# EAGLE design 0_cpu_interface (EAGLE 6.6.0)

## Sheet 1 of 2
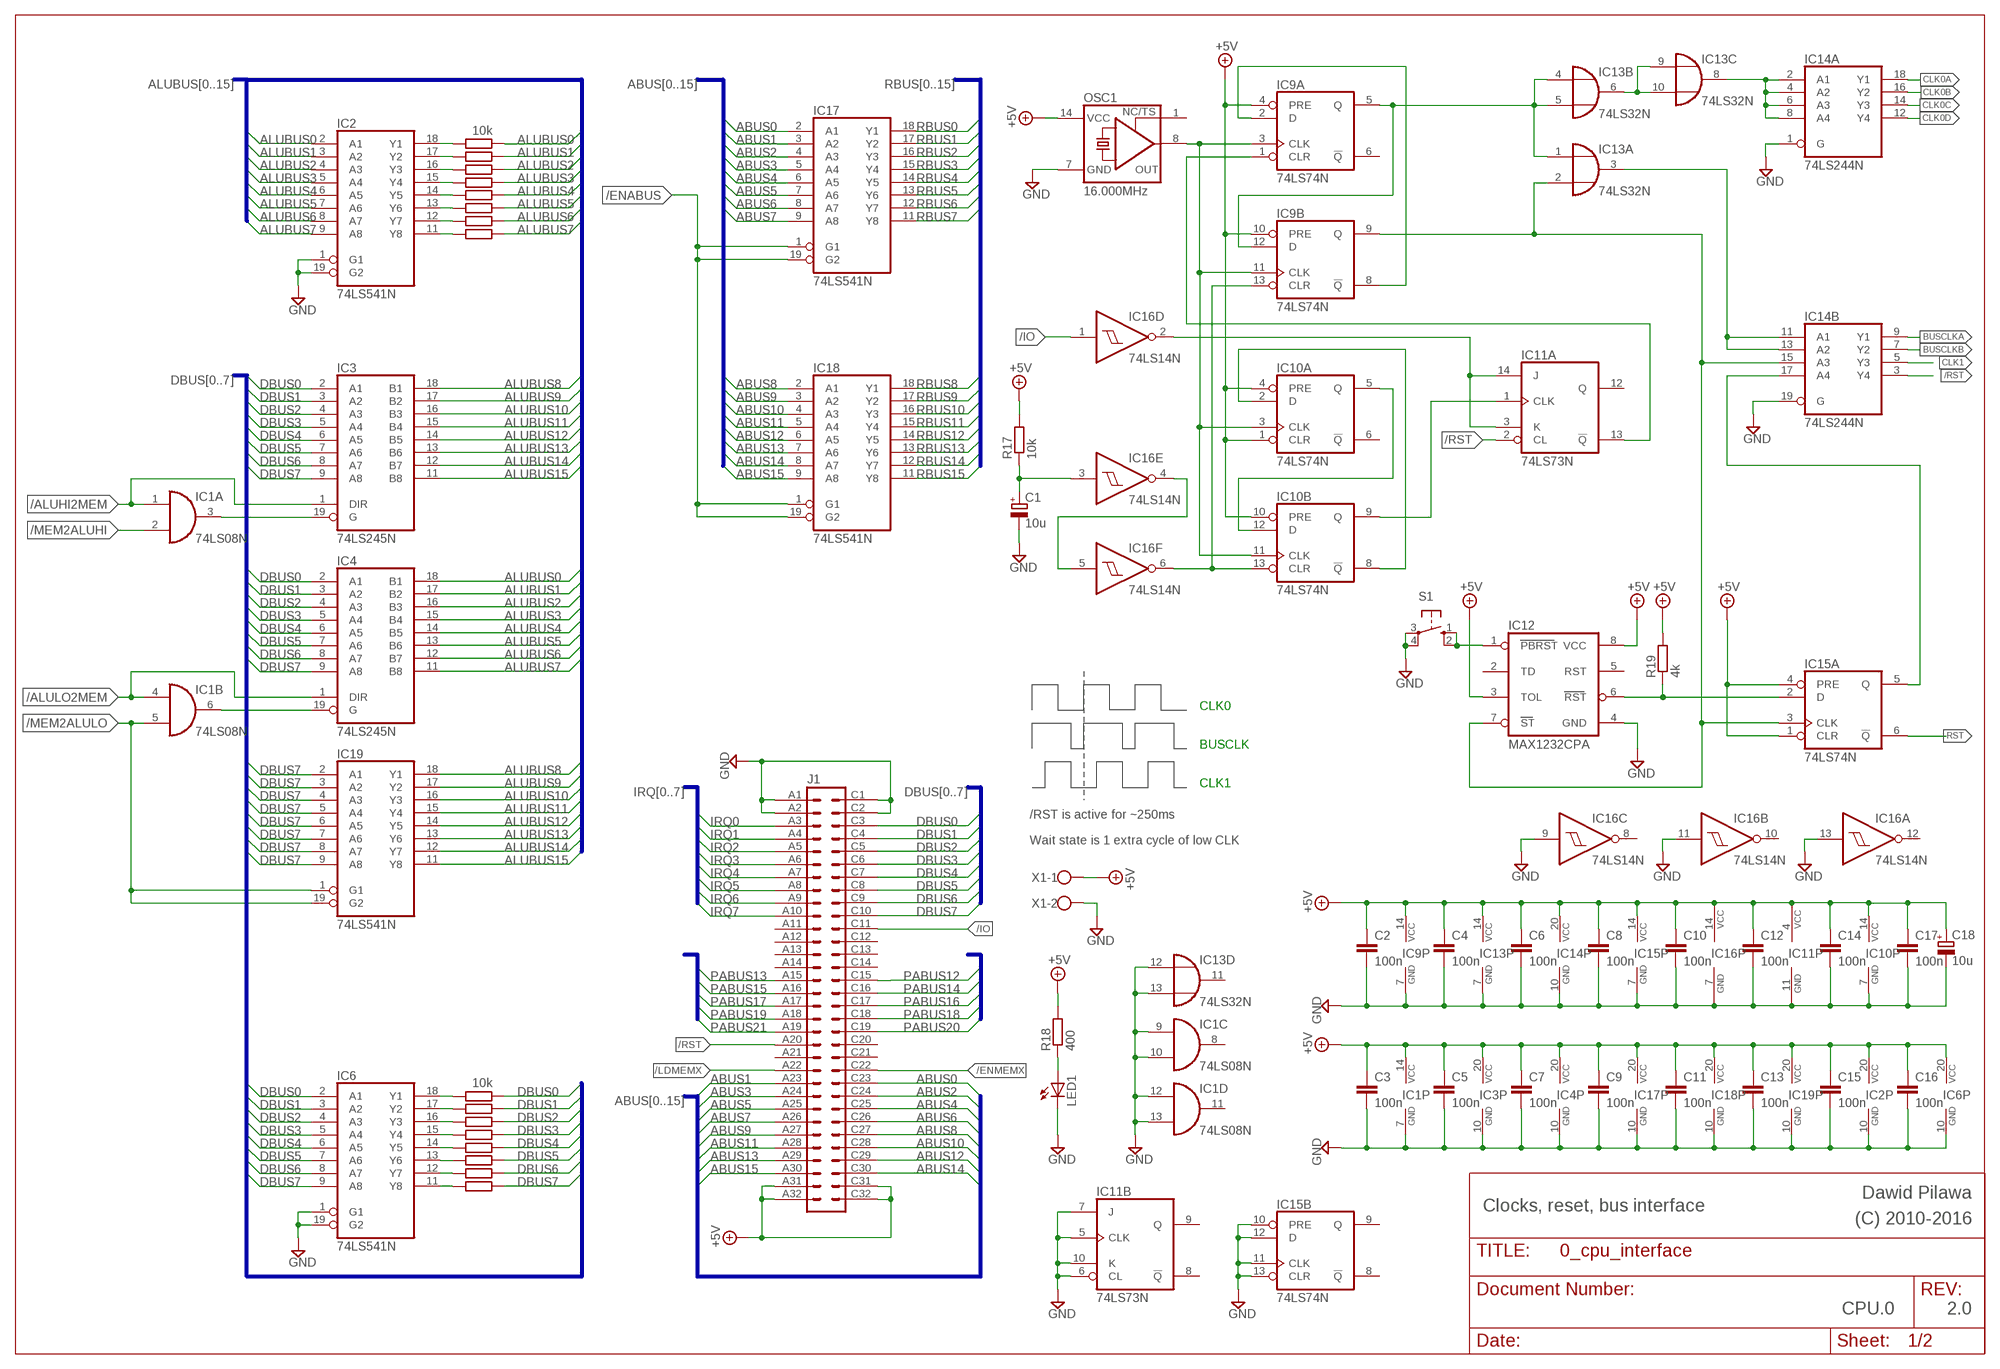
[diagram p0: schematic, sheet 1]

### Parts
C1  10u  CPOL-EUE2.5-5  [E2,5-5]
C2  100n  C-EU050-024X044  [C050-024X044]
C3  100n  C-EU050-024X044  [C050-024X044]
C4  100n  C-EU050-024X044  [C050-024X044]
C5  100n  C-EU050-024X044  [C050-024X044]
C6  100n  C-EU050-024X044  [C050-024X044]
C7  100n  C-EU050-024X044  [C050-024X044]
C8  100n  C-EU050-024X044  [C050-024X044]
C9  100n  C-EU050-024X044  [C050-024X044]
C10  100n  C-EU050-024X044  [C050-024X044]
C11  100n  C-EU050-024X044  [C050-024X044]
C12  100n  C-EU050-024X044  [C050-024X044]
C13  100n  C-EU050-024X044  [C050-024X044]
C14  100n  C-EU050-024X044  [C050-024X044]
C15  100n  C-EU050-024X044  [C050-024X044]
C16  100n  C-EU050-024X044  [C050-024X044]
C17  100n  C-EU050-024X044  [C050-024X044]
C18  10u  CPOL-EUE2.5-6  [E2,5-6]
IC1  74LS08N  [DIL14]
IC2  74LS541N  [DIL20]
IC3  74LS245N  [DIL20]
IC4  74LS245N  [DIL20]
IC6  74LS541N  [DIL20]
IC9  74LS74N  [DIL14]
IC10  74LS74N  [DIL14]
IC11  74LS73N  [DIL14]
IC12  MAX1232CPA  [DIL08]
IC13  74LS32N  [DIL14]
IC14  74LS244N  [DIL20]
IC15  74LS74N  [DIL14]
IC16  74LS14N  [DIL14]
IC17  74LS541N  [DIL20]
IC18  74LS541N  [DIL20]
IC19  74LS541N  [DIL20]
J1  VG64B  [VG64B]
LED1  LED5MM  [LED5MM]
OSC1  16.000MHz  XO-14  [DIL14S]
R1  10k  R-EU_0204/7  [0204/7]
R2  R-EU_0204/7  [0204/7]
R3  R-EU_0204/7  [0204/7]
R4  R-EU_0204/7  [0204/7]
R5  R-EU_0204/7  [0204/7]
R6  R-EU_0204/7  [0204/7]
R7  R-EU_0204/7  [0204/7]
R8  R-EU_0204/7  [0204/7]
R9  10k  R-EU_0204/7  [0204/7]
R10  R-EU_0204/7  [0204/7]
R11  R-EU_0204/7  [0204/7]
R12  R-EU_0204/7  [0204/7]
R13  R-EU_0204/7  [0204/7]
R14  R-EU_0204/7  [0204/7]
R15  R-EU_0204/7  [0204/7]
R16  R-EU_0204/7  [0204/7]
R17  10k  R-EU_0204/7  [0204/7]
R18  400  R-EU_0204/7  [0204/7]
R19  4k  R-EU_0204/7  [0204/7]
S1  10-XX  [B3F-10XX]
X1  W237-102  [W237-102]

### Nets
+5V: C2.1 C3.1 C4.1 C5.1 C6.1 C7.1 C8.1 C9.1 C10.1 C11.1 C12.1 C13.1 C14.1 C15.1 C16.1 C17.1 C18.+ IC1.14(P:VCC) IC2.20(VCC) IC3.20(VCC) IC4.20(VCC) IC6.20(VCC) IC9.4(A:PRE) IC9.10(B:PRE) IC9.14(P:VCC) IC10.1(A:CLR) IC10.4(A:PRE) IC10.10(B:PRE) IC10.14(P:VCC) IC11.4(P:VCC) IC12.3(TOL) IC12.8(VCC) IC13.14(P:VCC) IC14.20(P:VCC) IC15.1(A:CLR) IC15.4(A:PRE) IC15.14(P:VCC) IC16.14(P:VCC) IC17.20(VCC) IC18.20(VCC) IC19.20(VCC) J1.A31 J1.A32 J1.C31 J1.C32 OSC1.14(VCC) R17.2 R18.2 R19.2 X1.1 ; also sheet 2
/ALUHI2MEM: IC1.1(A:I0) IC3.1(DIR) ; also sheet 2
/ALULO2MEM: IC1.4(B:I0) IC4.1(DIR) ; also sheet 2
/ENABUS: IC17.1(G1) IC17.19(G2) IC18.1(G1) IC18.19(G2) ; also sheet 2
/ENMEMX: J1.C22 ; also sheet 2
/IO: IC16.1(D:I) J1.C11 ; also sheet 2
/LDMEMX: J1.A22 ; also sheet 2
/MEM2ALUHI: IC1.2(A:I1) ; also sheet 2
/MEM2ALULO: IC1.5(B:I1) IC19.1(G1) IC19.19(G2) ; also sheet 2
/RST: IC11.2(A:CL) IC14.3(B:Y4) J1.A20 ; also sheet 2
ABUS0: IC17.2(A1) J1.C23 ; also sheet 2
ABUS1: IC17.3(A2) J1.A23 ; also sheet 2
ABUS2: IC17.4(A3) J1.C24 ; also sheet 2
ABUS3: IC17.5(A4) J1.A24 ; also sheet 2
ABUS4: IC17.6(A5) J1.C25 ; also sheet 2
ABUS5: IC17.7(A6) J1.A25 ; also sheet 2
ABUS6: IC17.8(A7) J1.C26 ; also sheet 2
ABUS7: IC17.9(A8) J1.A26 ; also sheet 2
ABUS8: IC18.2(A1) J1.C27 ; also sheet 2
ABUS9: IC18.3(A2) J1.A27 ; also sheet 2
ABUS10: IC18.4(A3) J1.C28 ; also sheet 2
ABUS11: IC18.5(A4) J1.A28 ; also sheet 2
ABUS12: IC18.6(A5) J1.C29 ; also sheet 2
ABUS13: IC18.7(A6) J1.A29 ; also sheet 2
ABUS14: IC18.8(A7) J1.C30 ; also sheet 2
ABUS15: IC18.9(A8) J1.A30 ; also sheet 2
ALUBUS0: IC2.2(A1) IC4.18(B1) R1.2 ; also sheet 2
ALUBUS1: IC2.3(A2) IC4.17(B2) R2.2 ; also sheet 2
ALUBUS2: IC2.4(A3) IC4.16(B3) R3.2 ; also sheet 2
ALUBUS3: IC2.5(A4) IC4.15(B4) R4.2 ; also sheet 2
ALUBUS4: IC2.6(A5) IC4.14(B5) R5.2 ; also sheet 2
ALUBUS5: IC2.7(A6) IC4.13(B6) R6.2 ; also sheet 2
ALUBUS6: IC2.8(A7) IC4.12(B7) R7.2 ; also sheet 2
ALUBUS7: IC2.9(A8) IC4.11(B8) R8.2 ; also sheet 2
ALUBUS8: IC3.18(B1) IC19.18(Y1) ; also sheet 2
ALUBUS9: IC3.17(B2) IC19.17(Y2) ; also sheet 2
ALUBUS10: IC3.16(B3) IC19.16(Y3) ; also sheet 2
ALUBUS11: IC3.15(B4) IC19.15(Y4) ; also sheet 2
ALUBUS12: IC3.14(B5) IC19.14(Y5) ; also sheet 2
ALUBUS13: IC3.13(B6) IC19.13(Y6) ; also sheet 2
ALUBUS14: IC3.12(B7) IC19.12(Y7) ; also sheet 2
ALUBUS15: IC3.11(B8) IC19.11(Y8) ; also sheet 2
BUSCLK: IC13.3(A:O) IC14.11(B:A1) IC14.13(B:A2)
BUSCLKA: IC14.9(B:Y1) ; also sheet 2
BUSCLKB: IC14.7(B:Y2) ; also sheet 2
CLK0: IC9.5(A:Q) IC9.12(B:D) IC13.1(A:I0) IC13.4(B:I0) IC13.5(B:I1)
CLK0A: IC14.18(A:Y1) ; also sheet 2
CLK0B: IC14.16(A:Y2) ; also sheet 2
CLK0C: IC14.14(A:Y3) ; also sheet 2
CLK0D: IC14.12(A:Y4) ; also sheet 2
CLK1: IC14.5(B:Y3) ; also sheet 2
DBUS0: IC3.2(A1) IC4.2(A1) IC6.2(A1) J1.C3 R9.2 ; also sheet 2
DBUS1: IC3.3(A2) IC4.3(A2) IC6.3(A2) J1.C4 R10.2 ; also sheet 2
DBUS2: IC3.4(A3) IC4.4(A3) IC6.4(A3) J1.C5 R11.2 ; also sheet 2
DBUS3: IC3.5(A4) IC4.5(A4) IC6.5(A4) J1.C6 R12.2 ; also sheet 2
DBUS4: IC3.6(A5) IC4.6(A5) IC6.6(A5) J1.C7 R13.2 ; also sheet 2
DBUS5: IC3.7(A6) IC4.7(A6) IC6.7(A6) J1.C8 R14.2 ; also sheet 2
DBUS6: IC3.8(A7) IC4.8(A7) IC6.8(A7) J1.C9 R15.2 ; also sheet 2
DBUS7: IC3.9(A8) IC4.9(A8) IC6.9(A8) IC19.2(A1) IC19.3(A2) IC19.4(A3) IC19.5(A4) IC19.6(A5) IC19.7(A6) IC19.8(A7) IC19.9(A8) J1.C10 R16.2 ; also sheet 2
GND: C1.- C2.2 C3.2 C4.2 C5.2 C6.2 C7.2 C8.2 C9.2 C10.2 C11.2 C12.2 C13.2 C14.2 C15.2 C16.2 C17.2 C18.- IC1.7(P:GND) IC1.9(C:I0) IC1.10(C:I1) IC1.12(D:I0) IC1.13(D:I1) IC2.1(G1) IC2.10(GND) IC2.19(G2) IC3.10(GND) IC4.10(GND) IC6.1(G1) IC6.10(GND) IC6.19(G2) IC9.7(P:GND) IC10.7(P:GND) IC11.5(B:CLK) IC11.6(B:CL) IC11.7(B:J) IC11.10(B:K) IC11.11(P:GND) IC12.4(GND) IC13.7(P:GND) IC13.12(D:I0) IC13.13(D:I1) IC14.1(A:G) IC14.10(P:GND) IC14.19(B:G) IC15.7(P:GND) IC15.10(B:PRE) IC15.11(B:CLK) IC15.12(B:D) IC15.13(B:CLR) IC16.7(P:GND) IC16.9(C:I) IC16.11(B:I) IC16.13(A:I) IC17.10(GND) IC18.10(GND) IC19.10(GND) J1.A1 J1.A2 J1.C1 J1.C2 LED1.K(C) OSC1.7(GND) S1.3(P) S1.4(P1) X1.2 ; also sheet 2
IRQ0: J1.A3 ; also sheet 2
IRQ1: J1.A4 ; also sheet 2
IRQ2: J1.A5 ; also sheet 2
IRQ3: J1.A6 ; also sheet 2
IRQ4: J1.A7 ; also sheet 2
IRQ5: J1.A8 ; also sheet 2
IRQ6: J1.A9 ; also sheet 2
IRQ7: J1.A10 ; also sheet 2
N$1: IC1.3(A:O) IC3.19(G)
N$2: IC1.6(B:O) IC4.19(G)
N$3: IC2.18(Y1) R1.1
N$4: IC2.17(Y2) R2.1
N$5: IC2.16(Y3) R3.1
N$6: IC2.15(Y4) R4.1
N$7: IC2.14(Y5) R5.1
N$8: IC2.13(Y6) R6.1
N$9: IC2.12(Y7) R7.1
N$10: IC2.11(Y8) R8.1
N$11: IC6.18(Y1) R9.1
N$12: IC6.17(Y2) R10.1
N$13: IC6.16(Y3) R11.1
N$14: IC6.15(Y4) R12.1
N$15: IC6.14(Y5) R13.1
N$16: IC6.12(Y7) R15.1
N$17: IC6.11(Y8) R16.1
N$18: IC6.13(Y6) R14.1
N$19: IC12.1(PBRST) S1.1(S) S1.2(S1)
N$20: IC9.3(A:CLK) IC9.11(B:CLK) IC10.3(A:CLK) IC10.11(B:CLK) OSC1.8(OUT)
N$21: LED1.A R18.1
N$22: IC9.2(A:D) IC9.8(B:!Q)
N$23: IC14.17(B:A4) IC15.5(A:Q)
N$24: IC12.6(RST) IC15.2(A:D) R19.1
N$25: IC10.2(A:D) IC10.8(B:!Q)
N$26: IC13.8(C:O) IC14.2(A:A1) IC14.4(A:A2) IC14.6(A:A3) IC14.8(A:A4)
N$27: IC9.1(A:CLR) IC11.13(A:!Q)
N$28: C1.+ IC16.3(E:I) R17.1
N$29: IC13.6(B:O) IC13.9(C:I0) IC13.10(C:I1)
N$30: IC9.9(B:Q) IC12.7(ST) IC13.2(A:I1) IC14.15(B:A3) IC15.3(A:CLK)
N$31: IC10.5(A:Q) IC10.12(B:D)
N$32: IC10.9(B:Q) IC11.1(A:CLK)
N$33: IC11.3(A:K) IC11.14(A:J) IC16.2(D:O)
N$34: IC16.4(E:O) IC16.5(F:I)
N$35: IC9.13(B:CLR) IC10.13(B:CLR) IC16.6(F:O)
PABUS12: J1.C15 ; also sheet 2
PABUS13: J1.A15 ; also sheet 2
PABUS14: J1.C16 ; also sheet 2
PABUS15: J1.A16 ; also sheet 2
PABUS16: J1.C17 ; also sheet 2
PABUS17: J1.A17 ; also sheet 2
PABUS18: J1.C18 ; also sheet 2
PABUS19: J1.A18 ; also sheet 2
PABUS20: J1.C19 ; also sheet 2
PABUS21: J1.A19 ; also sheet 2
RBUS0: IC17.18(Y1) ; also sheet 2
RBUS1: IC17.17(Y2) ; also sheet 2
RBUS2: IC17.16(Y3) ; also sheet 2
RBUS3: IC17.15(Y4) ; also sheet 2
RBUS4: IC17.14(Y5) ; also sheet 2
RBUS5: IC17.13(Y6) ; also sheet 2
RBUS6: IC17.12(Y7) ; also sheet 2
RBUS7: IC17.11(Y8) ; also sheet 2
RBUS8: IC18.18(Y1) ; also sheet 2
RBUS9: IC18.17(Y2) ; also sheet 2
RBUS10: IC18.16(Y3) ; also sheet 2
RBUS11: IC18.15(Y4) ; also sheet 2
RBUS12: IC18.14(Y5) ; also sheet 2
RBUS13: IC18.13(Y6) ; also sheet 2
RBUS14: IC18.12(Y7) ; also sheet 2
RBUS15: IC18.11(Y8) ; also sheet 2
RST: IC15.6(A:!Q) ; also sheet 2
Unconnected: IC1.8(C:O) IC1.11(D:O) IC9.6(A:!Q) IC10.6(A:!Q) IC11.8(B:!Q) IC11.9(B:Q) IC11.12(A:Q) IC12.2(TD) IC12.5(RST) IC13.11(D:O) IC15.8(B:!Q) IC15.9(B:Q) IC16.8(C:O) IC16.10(B:O) IC16.12(A:O) J1.A11 J1.A12 J1.A13 J1.A14 J1.A21 J1.C12 J1.C13 J1.C14 J1.C20 J1.C21 OSC1.1(TS)

### Buses
DBUS[0..7]
ALUBUS[0..15]
RBUS[0..15]
IRQ[0..7]
ABUS[0..15]
PABUS[12..21]

### Notes on the sheet
- CLK0
- BUSCLK
- CLK1
- /RST is active for ~250ms
- Wait state is 1 extra cycle of low CLK
- Dawid Pilawa
- Clocks, reset, bus interface | (C) 2010-2016
- CPU.0 | 2.0

## Sheet 2 of 2
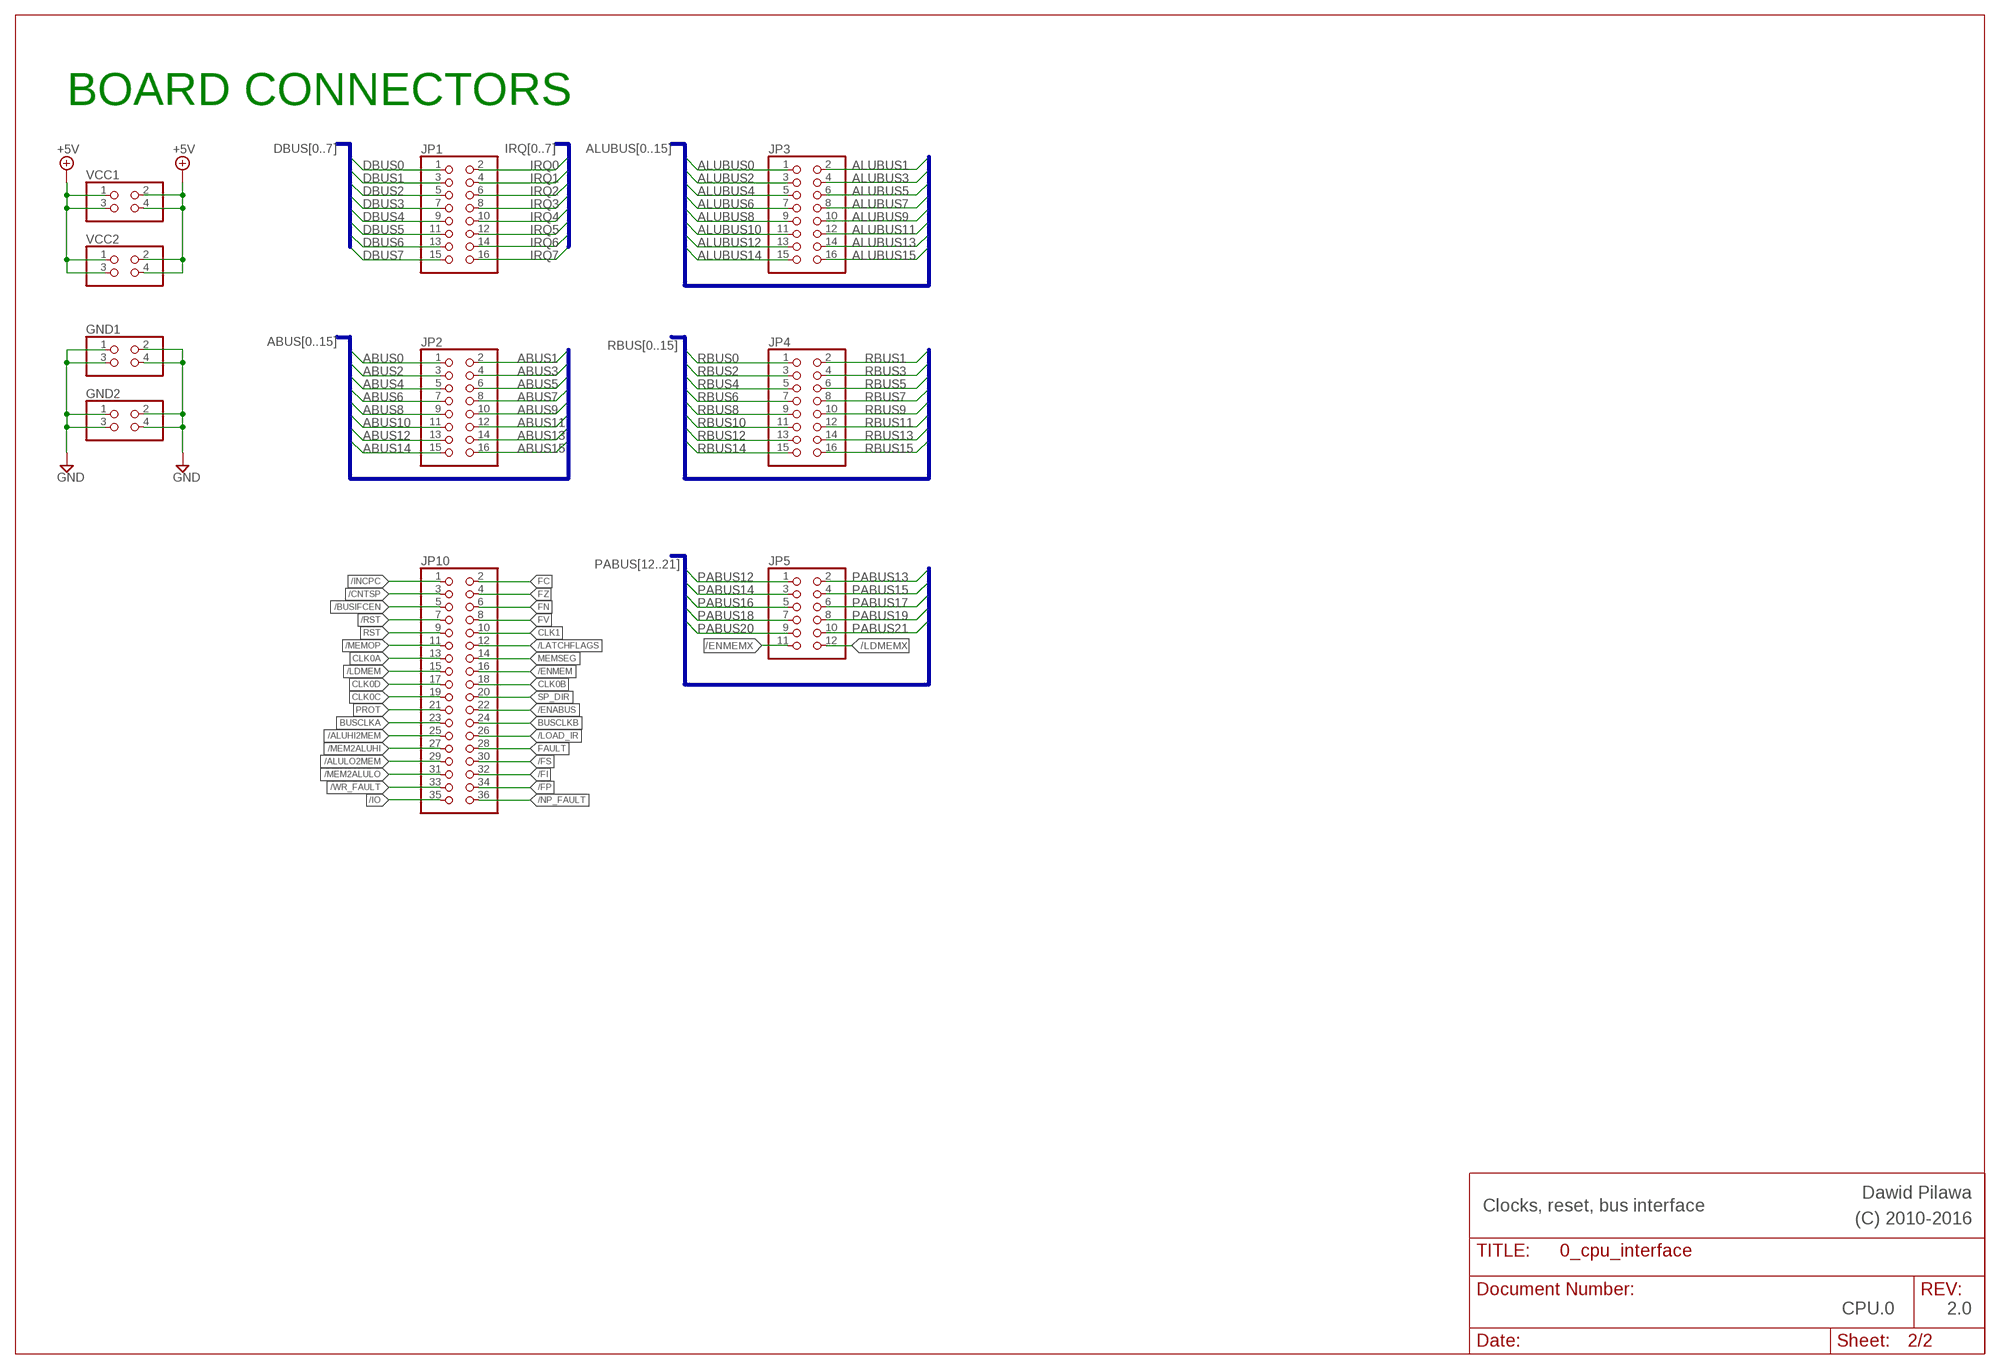
[diagram p1: schematic, sheet 2]

### Parts
GND1  PINHD-2X2  [2X02]
GND2  PINHD-2X2  [2X02]
JP1  PINHD-2X8  [2X08]
JP2  PINHD-2X8  [2X08]
JP3  PINHD-2X8  [2X08]
JP4  PINHD-2X8  [2X08]
JP5  PINHD-2X6  [2X06]
JP10  PINHD-2X18  [2X18]
VCC1  PINHD-2X2  [2X02]
VCC2  PINHD-2X2  [2X02]

### Nets
+5V: VCC1.1 VCC1.2 VCC1.3 VCC1.4 VCC2.1 VCC2.2 VCC2.3 VCC2.4 ; also sheet 1
/ALUHI2MEM: JP10.25 ; also sheet 1
/ALULO2MEM: JP10.29 ; also sheet 1
/BUSIFCEN: JP10.5
/CNTSP: JP10.3
/ENABUS: JP10.22 ; also sheet 1
/ENMEM: JP10.16
/ENMEMX: JP5.11 ; also sheet 1
/FI: JP10.32
/FP: JP10.34
/FS: JP10.30
/INCPC: JP10.1
/IO: JP10.35 ; also sheet 1
/LATCHFLAGS: JP10.12
/LDMEM: JP10.15
/LDMEMX: JP5.12 ; also sheet 1
/LOAD_IR: JP10.26
/MEM2ALUHI: JP10.27 ; also sheet 1
/MEM2ALULO: JP10.31 ; also sheet 1
/MEMOP: JP10.11
/NP_FAULT: JP10.36
/RST: JP10.7 ; also sheet 1
/WR_FAULT: JP10.33
ABUS0: JP2.1 ; also sheet 1
ABUS1: JP2.2 ; also sheet 1
ABUS2: JP2.3 ; also sheet 1
ABUS3: JP2.4 ; also sheet 1
ABUS4: JP2.5 ; also sheet 1
ABUS5: JP2.6 ; also sheet 1
ABUS6: JP2.7 ; also sheet 1
ABUS7: JP2.8 ; also sheet 1
ABUS8: JP2.9 ; also sheet 1
ABUS9: JP2.10 ; also sheet 1
ABUS10: JP2.11 ; also sheet 1
ABUS11: JP2.12 ; also sheet 1
ABUS12: JP2.13 ; also sheet 1
ABUS13: JP2.14 ; also sheet 1
ABUS14: JP2.15 ; also sheet 1
ABUS15: JP2.16 ; also sheet 1
ALUBUS0: JP3.1 ; also sheet 1
ALUBUS1: JP3.2 ; also sheet 1
ALUBUS2: JP3.3 ; also sheet 1
ALUBUS3: JP3.4 ; also sheet 1
ALUBUS4: JP3.5 ; also sheet 1
ALUBUS5: JP3.6 ; also sheet 1
ALUBUS6: JP3.7 ; also sheet 1
ALUBUS7: JP3.8 ; also sheet 1
ALUBUS8: JP3.9 ; also sheet 1
ALUBUS9: JP3.10 ; also sheet 1
ALUBUS10: JP3.11 ; also sheet 1
ALUBUS11: JP3.12 ; also sheet 1
ALUBUS12: JP3.13 ; also sheet 1
ALUBUS13: JP3.14 ; also sheet 1
ALUBUS14: JP3.15 ; also sheet 1
ALUBUS15: JP3.16 ; also sheet 1
BUSCLKA: JP10.23 ; also sheet 1
BUSCLKB: JP10.24 ; also sheet 1
CLK0A: JP10.13 ; also sheet 1
CLK0B: JP10.18 ; also sheet 1
CLK0C: JP10.19 ; also sheet 1
CLK0D: JP10.17 ; also sheet 1
CLK1: JP10.10 ; also sheet 1
DBUS0: JP1.1 ; also sheet 1
DBUS1: JP1.3 ; also sheet 1
DBUS2: JP1.5 ; also sheet 1
DBUS3: JP1.7 ; also sheet 1
DBUS4: JP1.9 ; also sheet 1
DBUS5: JP1.11 ; also sheet 1
DBUS6: JP1.13 ; also sheet 1
DBUS7: JP1.15 ; also sheet 1
FAULT: JP10.28
FC: JP10.2
FN: JP10.6
FV: JP10.8
FZ: JP10.4
GND: GND1.1 GND1.2 GND1.3 GND1.4 GND2.1 GND2.2 GND2.3 GND2.4 ; also sheet 1
IRQ0: JP1.2 ; also sheet 1
IRQ1: JP1.4 ; also sheet 1
IRQ2: JP1.6 ; also sheet 1
IRQ3: JP1.8 ; also sheet 1
IRQ4: JP1.10 ; also sheet 1
IRQ5: JP1.12 ; also sheet 1
IRQ6: JP1.14 ; also sheet 1
IRQ7: JP1.16 ; also sheet 1
MEMSEG: JP10.14
PABUS12: JP5.1 ; also sheet 1
PABUS13: JP5.2 ; also sheet 1
PABUS14: JP5.3 ; also sheet 1
PABUS15: JP5.4 ; also sheet 1
PABUS16: JP5.5 ; also sheet 1
PABUS17: JP5.6 ; also sheet 1
PABUS18: JP5.7 ; also sheet 1
PABUS19: JP5.8 ; also sheet 1
PABUS20: JP5.9 ; also sheet 1
PABUS21: JP5.10 ; also sheet 1
PROT: JP10.21
RBUS0: JP4.1 ; also sheet 1
RBUS1: JP4.2 ; also sheet 1
RBUS2: JP4.3 ; also sheet 1
RBUS3: JP4.4 ; also sheet 1
RBUS4: JP4.5 ; also sheet 1
RBUS5: JP4.6 ; also sheet 1
RBUS6: JP4.7 ; also sheet 1
RBUS7: JP4.8 ; also sheet 1
RBUS8: JP4.9 ; also sheet 1
RBUS9: JP4.10 ; also sheet 1
RBUS10: JP4.11 ; also sheet 1
RBUS11: JP4.12 ; also sheet 1
RBUS12: JP4.13 ; also sheet 1
RBUS13: JP4.14 ; also sheet 1
RBUS14: JP4.15 ; also sheet 1
RBUS15: JP4.16 ; also sheet 1
RST: JP10.9 ; also sheet 1
SP_DIR: JP10.20

### Buses
DBUS[0..7]
ALUBUS[0..15]
RBUS[0..15]
IRQ[0..7]
ABUS[0..15]
PABUS[12..21]

### Notes on the sheet
- BOARD CONNECTORS
- Dawid Pilawa
- Clocks, reset, bus interface | (C) 2010-2016
- CPU.0 | 2.0

## Library data of the parts
C1 C18 = rcl:CPOL-EU: POLARIZED CAPACITOR, European symbol
C2-C17 = rcl:C-EU: CAPACITOR, European symbol
GND1 GND2 VCC1 VCC2 = pinhead:PINHD-2X2: PIN HEADER
IC1 = 74xx-eu:74*08: Quad 2-input AND gate
IC2 IC6 IC17-IC19 = 74xx-eu:74*541: Octal BUFFER and LINE DRIVER, 3-state
IC3 IC4 = 74xx-eu:74*245: Octal BUS TRANSCEIVER, 3-state
IC9 IC10 IC15 = 74xx-eu:74*74: Dual D type positive edge triggered FLIP FLOP, preset and clear
IC11 = 74xx-us:74*73: Dual J-K FLIP FLOP, clear
IC12 = maxim:MAX1232CPA: MONITOR DEVICE; MPN: MAX1232CPA; OC_FARNELL: 9723757; OC_NEWARK: 34C3766
IC13 = 74xx-eu:74*32: Quad 2-input OR gate
IC14 = 74xx-eu:74*244: Octal BUFFER and LINE DRIVER, 3-state
IC16 = 74xx-us:74*14: Hex schmitt trigger INVERTER
J1 = 19inch:VG64: PCB EUROCARD, 64-pin type C/AC, 2.54 mm
JP1-JP4 = pinhead:PINHD-2X8: PIN HEADER
JP5 = pinhead:PINHD-2X6: PIN HEADER
JP10 = pinhead:PINHD-2X18: PIN HEADER
LED1 = led:LED: LED OSRAM: - CHIPLED LG R971, LG N971, LY N971, LG Q971, LY Q971, LO R971, LY R971 LH N974, LH R974 LS Q976, LO Q976, LY Q976 LO Q996 - Hyper CHIPLED LW Q18S LB Q993, LB Q99A, LB R99A - SideLED LS A670, LO A670, LY A670, LG A670, LP A670 LB A673, LV A673, LT A673, LW A673 LH A674 LY A675 LS A676, LA A676, LO A676, LY A676, LW A676 LS A679, LY A679, LG A679 - Hyper Micro SIDELED® LS Y876, LA Y876, LO Y876, LY Y876 LT Y87S - SmartLED LW L88C, LW L88S LB L89C, LB L89S, LG L890 LS L89K, LO L89K, LY L89K LS L896, LA L896, LO L896, LY L896 - TOPLED LS T670, LO T670, LY T670, LG T670, LP T670 LSG T670, LSP T670, LSY T670, LOP T670, LYG T670 LG T671, LOG T671, LSG T671 LB T673, LV T673, LT T673, LW T673 LH T674 LS T676, LA T676, LO T676, LY T676, LB T676, LH T676, LSB T676, LW T676 LB T67C, LV T67C, LT T67C, LS T67K, LO T67K, LY T67K, LW E67C LS E67B, LA E67B, LO E67B, LY E67B, LB E67C, LV E67C, LT E67C LW T67C LS T679, LY T679, LG T679 LS T770, LO T770, LY T770, LG T770, LP T770 LB T773, LV T773, LT T773, LW T773 LH T774 LS E675, LA E675, LY E675, LS T675 LS T776, LA T776, LO T776, LY T776, LB T776 LHGB T686 LT T68C, LB T68C - Hyper Mini TOPLED® LB M676 - Mini TOPLED Santana® LG M470 LS M47K, LO M47K, LY M47K Source: http://www.osram.convergy.de LUXEON: - LUMILED® LXK2-PW12-R00, LXK2-PW12-S00, LXK2-PW14-U00, LXK2-PW14-V00 LXK2-PM12-R00, LXK2-PM12-S00, LXK2-PM14-U00 LXK2-PE12-Q00, LXK2-PE12-R00, LXK2-PE12-S00, LXK2-PE14-T00, LXK2-PE14-U00 LXK2-PB12-K00, LXK2-PB12-L00, LXK2-PB12-M00, LXK2-PB14-N00, LXK2-PB14-P00, LXK2-PB14-Q00 LXK2-PR12-L00, LXK2-PR12-M00, LXK2-PR14-Q00, LXK2-PR14-R00 LXK2-PD12-Q00, LXK2-PD12-R00, LXK2-PD12-S00 LXK2-PH12-R00, LXK2-PH12-S00 LXK2-PL12-P00, LXK2-PL12-Q00, LXK2-PL12-R00 Source: www.luxeon.com KINGBRIGHT: KA-3528ASYC Source: www.kingbright.com
OSC1 = crystal:XO-: CRYSTAL; OC_FARNELL: unknown; OC_NEWARK: unknown
R1-R19 = rcl:R-EU_: RESISTOR, European symbol
S1 = switch-omron:10-XX: OMRON SWITCH; MPN: B3F-1000; OC_FARNELL: 176432; OC_NEWARK: 36M3542
X1 = con-wago-500:W237-102: WAGO SCREW CLAMP; MPN: 237-102; OC_FARNELL: unknown; OC_NEWARK: 70K9898

## Board
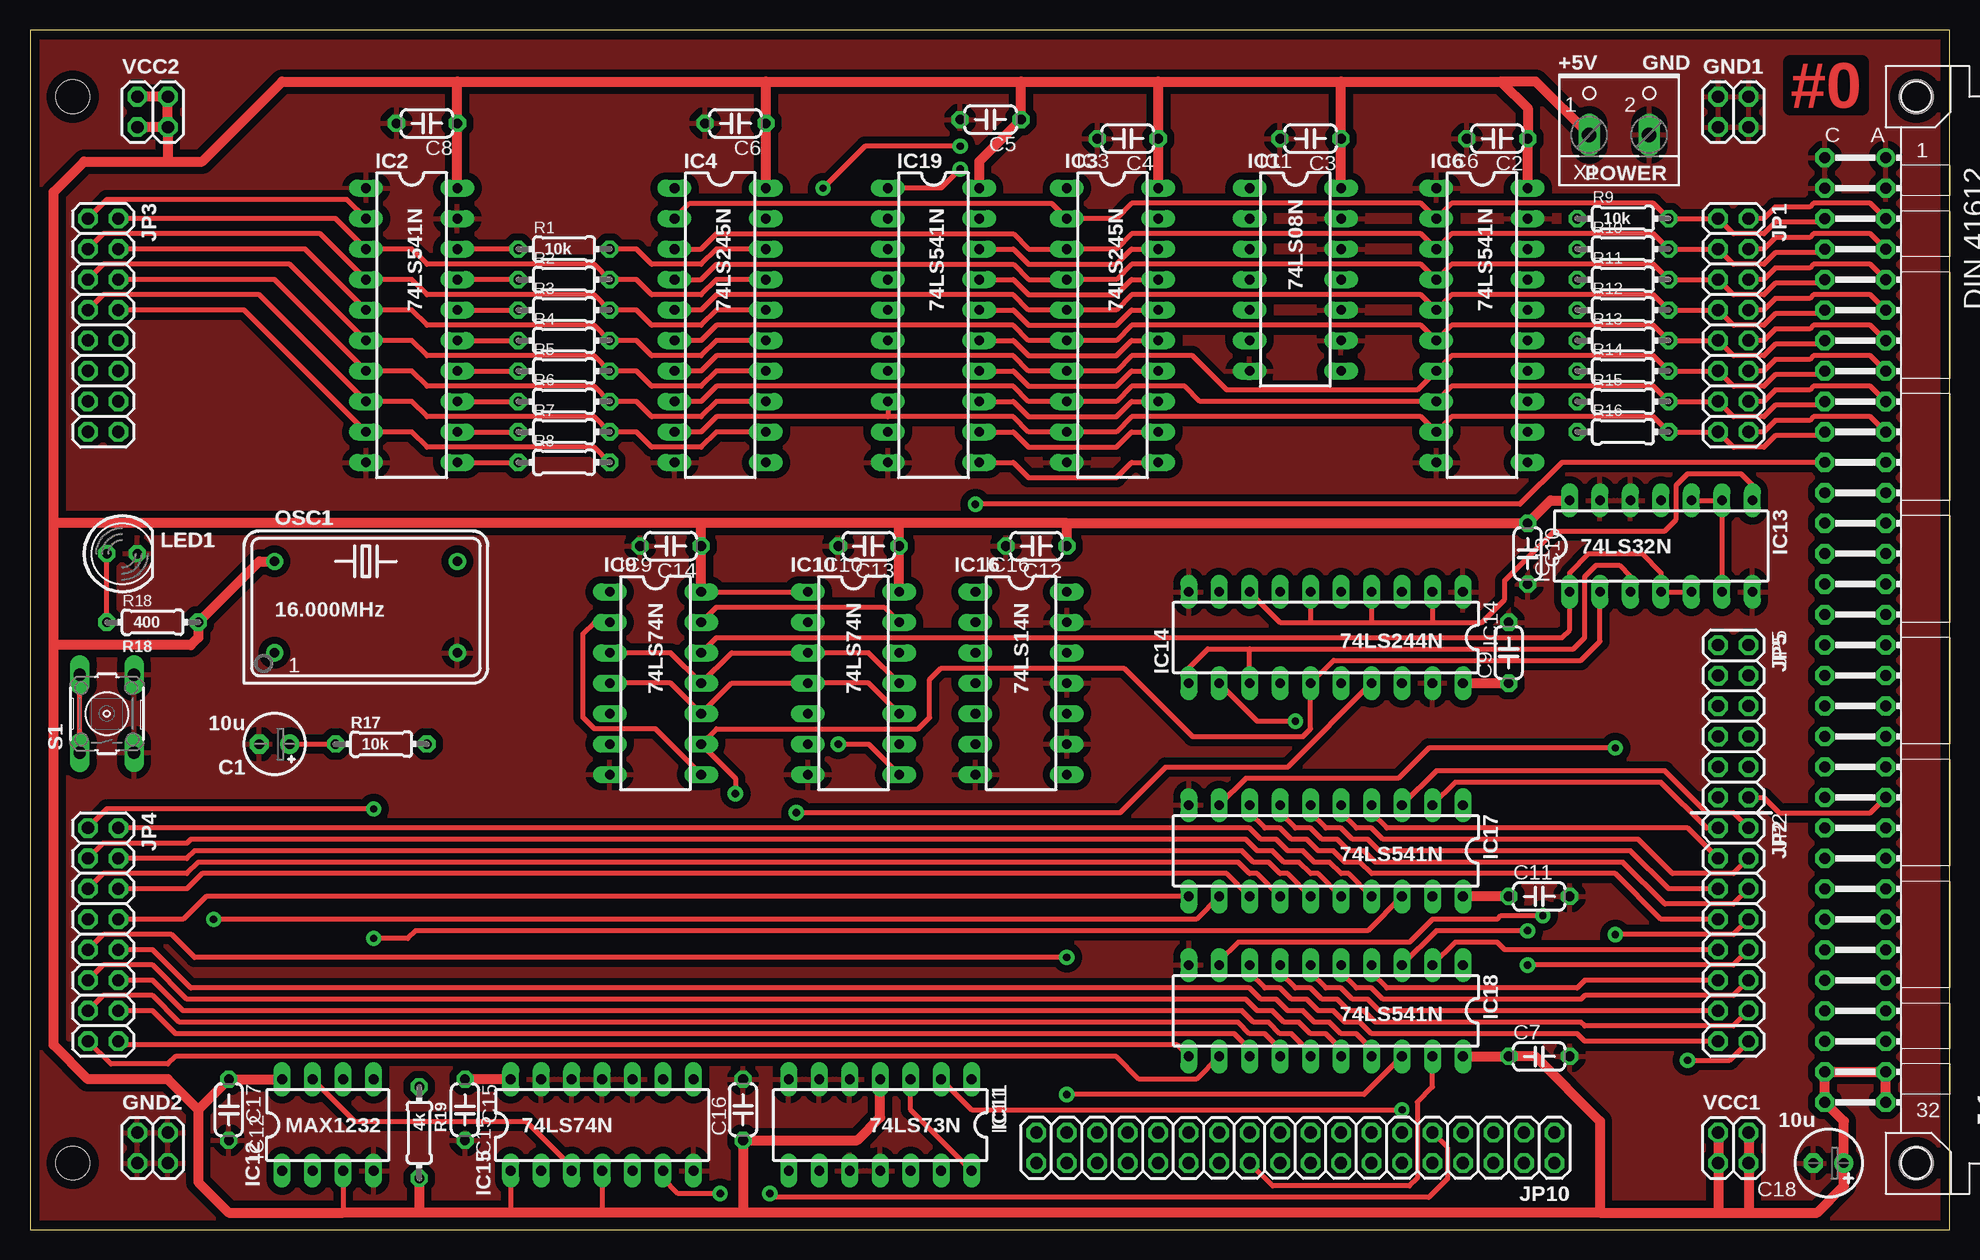
[diagram p2: board, top side]
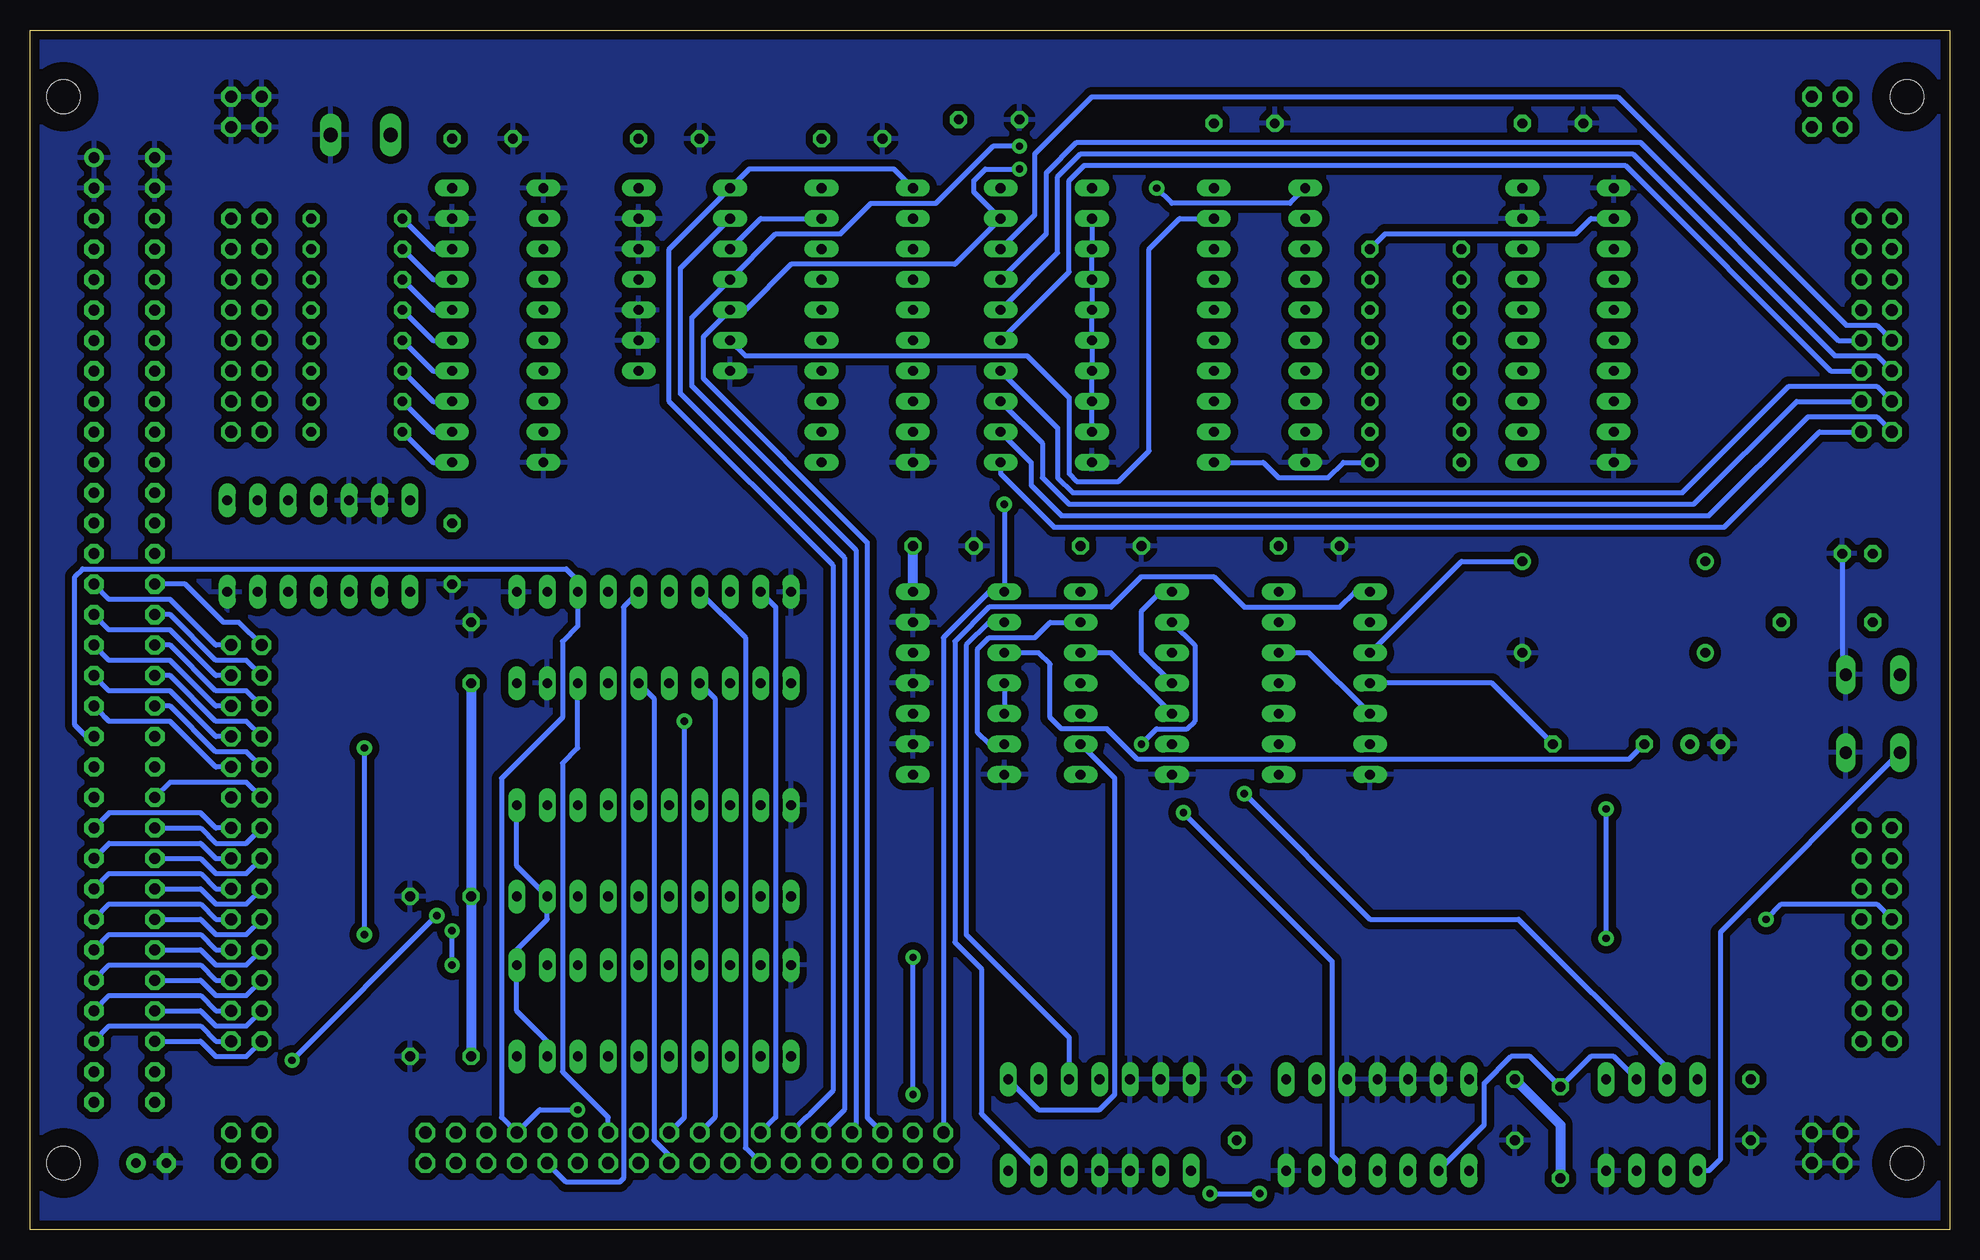
[diagram p3: board, bottom side, seen from below]

Size 160.02 x 100.03 mm. Coordinates in mm from the lower left corner, seen from the top.
Copper layers (1*16): Top 0.035mm / dielectric 1.5mm / Bottom 0.035mm
Design rules "homebrew_pcb": minimum track width 16mil, minimum drill 24mil, track to track 16mil, track to pad 10mil, pad to pad 10mil, via to via 10mil, smd to smd 8mil, copper to edge 30mil, drill to drill 10mil, minimum pad ring 12mil, minimum via ring 12mil, stop-mask expansion 4mil, vias tented up to drill 0mil, thermal gap 24mil

### Footprints (pad centres in the part's own frame; a part is rotated, then mirrored left to right if it is on the bottom)
E2,5-5 = drill 0.813 pad 1.6: + -1.27,0 | drill 0.813 pad 1.6 octagon: - 1.27,0
C050-024X044 = drill 0.813 octagon: 1 -2.54,0; 2 2.54,0
E2,5-6 = drill 0.813 pad 1.6: + -1.27,0 | drill 0.813 pad 1.6 octagon: - 1.27,0
2X02 = drill 1.016 octagon: 1 -1.27,-1.27; 2 -1.27,1.27; 3 1.27,-1.27; 4 1.27,1.27
DIL14 = drill 0.813 long: 1 -7.62,-3.81; 2 -5.08,-3.81; 3 -2.54,-3.81; 4 0,-3.81; 5 2.54,-3.81; 6 5.08,-3.81; 7 7.62,-3.81; 8 7.62,3.81; 9 5.08,3.81; 10 2.54,3.81; 11 0,3.81; 12 -2.54,3.81; 13 -5.08,3.81; 14 -7.62,3.81
DIL20 = drill 0.813 long: 1 -11.43,-3.81; 2 -8.89,-3.81; 3 -6.35,-3.81; 4 -3.81,-3.81; 5 -1.27,-3.81; 6 1.27,-3.81; 7 3.81,-3.81; 8 6.35,-3.81; 9 8.89,-3.81; 10 11.43,-3.81; 11 11.43,3.81; 12 8.89,3.81; 13 6.35,3.81; 14 3.81,3.81; 15 1.27,3.81; 16 -1.27,3.81; 17 -3.81,3.81; 18 -6.35,3.81; 19 -8.89,3.81; 20 -11.43,3.81
DIL08 = drill 0.813 long: 1 -3.81,-3.81; 2 -1.27,-3.81; 3 1.27,-3.81; 4 3.81,-3.81; 5 3.81,3.81; 6 1.27,3.81; 7 -1.27,3.81; 8 -3.81,3.81
VG64B = drill 0.914 pad 1.6: A1 154.94,39.37 | drill 0.914 pad 1.6 octagon: A2 154.94,36.83; A3 154.94,34.29; A4 154.94,31.75; A5 154.94,29.21; A6 154.94,26.67; A7 154.94,24.13; A8 154.94,21.59; A9 154.94,19.05; A10 154.94,16.51; A11 154.94,13.97; A12 154.94,11.43; A13 154.94,8.89; A14 154.94,6.35; A15 154.94,3.81; A16 154.94,1.27; A17 154.94,-1.27; A18 154.94,-3.81; A19 154.94,-6.35; A20 154.94,-8.89; A21 154.94,-11.43; A22 154.94,-13.97; A23 154.94,-16.51; A24 154.94,-19.05; A25 154.94,-21.59; A26 154.94,-24.13; A27 154.94,-26.67; A28 154.94,-29.21; A29 154.94,-31.75; A30 154.94,-34.29; A31 154.94,-36.83; A32 154.94,-39.37; C1 149.86,39.37; C2 149.86,36.83; C3 149.86,34.29; C4 149.86,31.75; C5 149.86,29.21; C6 149.86,26.67; C7 149.86,24.13; C8 149.86,21.59; C9 149.86,19.05; C10 149.86,16.51; C11 149.86,13.97; C12 149.86,11.43; C13 149.86,8.89; C14 149.86,6.35; C15 149.86,3.81; C16 149.86,1.27; C17 149.86,-1.27; C18 149.86,-3.81; C19 149.86,-6.35; C20 149.86,-8.89; C21 149.86,-11.43; C22 149.86,-13.97; C23 149.86,-16.51; C24 149.86,-19.05; C25 149.86,-21.59; C26 149.86,-24.13; C27 149.86,-26.67; C28 149.86,-29.21; C29 149.86,-31.75; C30 149.86,-34.29; C31 149.86,-36.83; C32 149.86,-39.37 | hole 2.794: 157.48,44.45; 157.48,-44.45; 3.81,-44.45; 3.81,44.45
2X08 = drill 1.016 octagon: 1 -8.89,-1.27; 2 -8.89,1.27; 3 -6.35,-1.27; 4 -6.35,1.27; 5 -3.81,-1.27; 6 -3.81,1.27; 7 -1.27,-1.27; 8 -1.27,1.27; 9 1.27,-1.27; 10 1.27,1.27; 11 3.81,-1.27; 12 3.81,1.27; 13 6.35,-1.27; 14 6.35,1.27; 15 8.89,-1.27; 16 8.89,1.27
2X06 = drill 1.016 octagon: 1 -6.35,-1.27; 2 -6.35,1.27; 3 -3.81,-1.27; 4 -3.81,1.27; 5 -1.27,-1.27; 6 -1.27,1.27; 7 1.27,-1.27; 8 1.27,1.27; 9 3.81,-1.27; 10 3.81,1.27; 11 6.35,-1.27; 12 6.35,1.27
2X18 = drill 1.016 octagon: 1 -21.59,-1.27; 2 -21.59,1.27; 3 -19.05,-1.27; 4 -19.05,1.27; 5 -16.51,-1.27; 6 -16.51,1.27; 7 -13.97,-1.27; 8 -13.97,1.27; 9 -11.43,-1.27; 10 -11.43,1.27; 11 -8.89,-1.27; 12 -8.89,1.27; 13 -6.35,-1.27; 14 -6.35,1.27; 15 -3.81,-1.27; 16 -3.81,1.27; 17 -1.27,-1.27; 18 -1.27,1.27; 19 1.27,-1.27; 20 1.27,1.27; 21 3.81,-1.27; 22 3.81,1.27; 23 6.35,-1.27; 24 6.35,1.27; 25 8.89,-1.27; 26 8.89,1.27; 27 11.43,-1.27; 28 11.43,1.27; 29 13.97,-1.27; 30 13.97,1.27; 31 16.51,-1.27; 32 16.51,1.27; 33 19.05,-1.27; 34 19.05,1.27; 35 21.59,-1.27; 36 21.59,1.27
LED5MM = drill 0.813 octagon: A -1.27,0; K 1.27,0
DIL14S = drill 0.813: 1 -7.62,-3.81; 7 7.62,-3.81; 8 7.62,3.81; 14 -7.62,3.81
0204/7 = drill 0.813 octagon: 1 -3.81,0; 2 3.81,0
B3F-10XX = drill 1.016 long: 1 -3.251,2.261; 2 3.251,2.261; 3 -3.251,-2.261; 4 3.251,-2.261
W237-102 = drill 1.194 long: 1 -2.5,-1.27; 2 2.5,-1.27

### Placement (x,y rotation side)
C1  20.38,40.49 180 top
C2  122.3,90.97 180 top
C3  106.74,90.97 180 top
C4  91.5,90.97 180 top
C5  80.07,92.56 180 top
C6  58.8,92.24 180 top
C7  125.79,14.45 0 top
C8  33.08,92.24 180 top
C9  123.25,48.11 90 top
C10  124.84,56.36 270 top
C11  125.79,27.79 0 top
C12  83.88,57 180 top
C13  69.91,57 180 top
C14  53.4,57 180 top
C15  36.26,10.01 270 top
C16  59.44,10.01 90 top
C17  16.57,10.01 270 top
C18  149.92,5.56 180 top
GND1  141.99,93.19 0 top
GND2  10.22,6.83 0 top
IC1  105.47,79.22 270 top
IC2  31.81,75.41 270 top
IC3  90.23,75.41 270 top
IC4  57.53,75.41 270 top
IC6  121.03,75.41 270 top
IC9  52.13,45.57 270 top
IC10  68.64,45.57 270 top
IC11  70.87,8.74 180 top
IC12  24.83,8.74 0 top
IC13  135.95,57 0 top
IC14  108.01,49.38 180 top
IC15  47.69,8.74 0 top
IC16  82.61,45.57 270 top
IC17  108.01,31.6 180 top
IC18  108.01,18.26 180 top
IC19  75.31,75.41 270 top
J1  -0.25,50.01 0 top
JP1  141.99,75.41 270 top
JP2  141.99,24.61 270 top
JP3  6.1,75.41 270 top
JP4  6.1,24.61 270 top
JP5  141.99,42.39 270 top
JP10  105.47,6.83 180 top
LED1  7.68,56.36 0 top
OSC1  28,51.92 0 top
R1  44.51,81.76 0 top
R2  44.51,79.22 0 top
R3  44.51,76.68 0 top
R4  44.51,74.14 0 top
R5  44.51,71.6 0 top
R6  44.51,69.06 0 top
R7  44.51,66.52 0 top
R8  44.51,63.98 0 top
R9  132.78,84.3 0 top
R10  132.78,81.76 0 top
R11  132.78,79.22 0 top
R12  132.78,76.68 0 top
R13  132.78,74.14 0 top
R14  132.78,71.6 0 top
R15  132.78,69.06 0 top
R16  132.78,66.52 0 top
R17  29.27,40.49 0 top
R18  10.22,50.65 0 top
R19  32.45,8.1 270 top
S1  6.41,43.03 90 top
VCC1  141.99,6.83 0 top
VCC2  10.22,93.19 0 top
X1  132.46,92.56 0 top

### Tracks (layer width: path | path; a pad name or v marks a point on that pad's centre or on a via)
+5V
  Top 0.406: IC12.3 26.1,1.43 | IC15.1 40.07,1.43 | IC15.4 47.69,1.43 | IC10.10 69.91,45.57 IC10.4 58.48,45.57 IC9.10 53.4,45.57 IC9.4 | IC9.14 IC10.1
  Top 0.813: 130.87,1.43 59.44,1.43 | 59.44,1.43 47.69,1.43 40.07,1.43 32.45,1.43 | 32.45,1.43 26.1,1.43 16.57,1.43 14.03,3.98 14.03,10.01 | 1.97,48.74 1.97,58.9 | 1.97,58.9 1.97,86.52 4.51,89.07 11.49,89.07 | 35.62,95.73 21.02,95.73 14.35,89.07 11.49,89.07 | 35.62,95.73 61.34,95.73 | 61.34,95.73 82.61,95.73 | 82.61,95.73 94.04,95.73 | 94.04,95.73 109.28,95.73 | 109.28,95.73 122.62,95.73 | 122.62,95.73 124.84,93.51 C2.1 IC6.20 | 109.28,95.73 C3.1 IC1.14 | 94.04,95.73 C4.1 IC3.20 | 86.42,58.9 72.45,58.9 | 72.45,58.9 55.94,58.9 | 55.94,58.9 1.97,58.9 | C12.1 86.42,58.9 | 72.45,58.9 C13.1 IC10.14 | 55.94,58.9 C14.1 IC9.14 | OSC1.14 19.11,55.73 R18.2 14.03,49.38 13.4,48.74 1.97,48.74 | IC15.14 C15.1 | IC12.8 C17.1 14.03,10.01 | 59.44,1.43 C16.1 68.96,7.47 70.87,9.37 IC11.4 | 1.97,48.74 1.97,15.4 4.83,12.55 11.49,12.55 14.03,10.01 | 86.42,58.9 C10.1 126.75,60.81 IC13.14 | 130.87,1.43 130.87,9.05 125.48,14.45 C7.1 IC18.20 | 130.87,1.43 140.72,1.43 | 140.72,1.43 143.26,1.43 | 143.26,1.43 148.97,1.43 151.19,3.66 C18.+ 151.19,9.05 J1.C32 J1.C31 J1.A31 J1.A32 | 143.26,1.43 VCC1.3 VCC1.4 | 140.72,1.43 VCC1.1 VCC1.2 | IC14.20 C9.1 | IC4.20 C6.1 61.34,95.73 | IC2.20 C8.1 35.62,95.73 | R19.2 32.45,1.43 | C11.1 IC17.20 | VCC2.3 11.49,89.07 | VCC2.3 VCC2.1 | VCC2.3 VCC2.4 VCC2.2 | IC19.20 79.12,89.07 C5.1 82.61,95.73 | X1.1 125.52,95.73 122.62,95.73
  Bottom 0.406: R17.2 38.16,45.57 IC9.4 | IC10.4 67.37,48.11 67.37,51.6 65.79,53.19 IC10.1
  Bottom 0.813: IC16.14 C12.1 | C15.1 32.45,8.74 R19.2 | C7.1 C11.1 C9.1
/ALUHI2MEM
  Bottom 0.406: IC3.1 88.01,88.43 100.08,88.43 IC1.1 106.74,81.76 106.74,69.06 93.09,55.41 93.09,11.6 95,9.69 95.31,9.37 JP10.25
/ALULO2MEM  (via drill 0.61 pad 1.27)
  Top 0.406: v77.53,90.33 69.6,90.33 v66.1,86.84
  Bottom 0.406: v77.53,90.33 79.76,90.33 84.52,85.57 89.92,85.57 92.46,83.03 97.85,83.03 IC1.4 104.84,76.05 104.84,70.33 91.19,56.68 91.19,8.42 JP10.29 | IC4.1 54.99,85.57 64.83,85.57 v66.1,86.84
/ENABUS
  Top 0.406: IC18.19 116.9,11.91 115.63,10.64 115.63,4.29 115,3.66 103.57,3.66 JP10.22
  Bottom 0.406: IC17.1 119.44,30.33 IC17.19 116.9,25.88 119.44,23.34 IC18.1 119.44,18.26 116.9,15.72 IC18.19
/ENMEMX
  Bottom 0.406: JP5.11 141.99,37.31 148.34,37.31 J1.C22
/IO  (via drill 0.61 pad 1.27)
  Top 0.406: J1.C11 127.7,63.98 124.21,60.49 v78.8,60.49
  Bottom 0.406: JP10.35 83.88,49.38 80.07,53.19 IC16.1 v78.8,60.49
/LDMEMX
  Top 0.406: JP5.12 144.53,36.04 145.8,34.77 153.42,34.77 J1.A22
/MEM2ALUHI
  Bottom 0.406: IC1.2 105.79,80.18 105.79,69.7 92.14,56.04 92.14,10.01 JP10.27
/MEM2ALULO  (via drill 0.61 pad 1.27)
  Top 0.406: v77.53,88.43 75.95,86.84 IC19.1
  Bottom 0.406: v77.53,88.43 80.39,88.43 81.34,87.48 81.34,86.52 IC19.19 82.93,80.49 96.58,80.49 100.39,76.68 IC1.5 103.89,74.46 103.89,70.97 90.23,57.32 90.23,9.37 JP10.31
/RST  (via drill 0.61 pad 1.27)
  Top 0.406: IC11.2 78.49,10.01 v114.36,10.01
  Bottom 0.406: v114.36,10.01 117.54,10.01 JP10.7 120.71,9.37 120.71,37.63 115.63,42.71 115.63,49.06 114.36,50.33 IC14.3 114.36,54.14 115.32,55.09 155.64,55.09 156.27,54.46 156.27,42.07 155.32,41.12 J1.A20
ABUS0
  Top 0.406: IC17.2 118.81,37.31 135.95,37.31 139.76,33.5 JP2.1
  Bottom 0.406: J1.C23 145.8,33.5 144.53,32.23 141.99,32.23 JP2.1
ABUS1
  Top 0.406: IC17.3 117.22,38.26 136.27,38.26 139.76,34.77 141.99,34.77 JP2.2
  Bottom 0.406: JP2.2 144.53,33.5 145.8,34.77 153.42,34.77 J1.A23
ABUS2
  Top 0.406: JP2.3 138.18,33.5 113.09,33.5 111.82,34.77 IC17.4
  Bottom 0.406: J1.C24 145.8,30.96 144.53,29.69 141.99,29.69 JP2.3
ABUS3
  Top 0.406: JP2.4 141.99,29.69 136.91,29.69 134.05,32.55 112.78,32.55 111.82,33.5 110.55,33.5 109.28,34.77 IC17.5
  Bottom 0.406: J1.A24 153.42,32.23 145.8,32.23 144.53,30.96 JP2.4
ABUS4
  Top 0.406: JP2.5 136.59,28.42 133.41,31.6 112.46,31.6 111.51,32.55 110.24,32.55 109.28,33.5 108.01,33.5 106.74,34.77 IC17.6
  Bottom 0.406: J1.C25 145.8,28.42 144.53,27.15 141.99,27.15 JP2.5
ABUS5
  Top 0.406: JP2.6 141.99,27.15 136.27,27.15 132.78,30.64 112.14,30.64 111.19,31.6 109.92,31.6 108.97,32.55 107.7,32.55 106.74,33.5 105.47,33.5 104.2,34.77 IC17.7
  Bottom 0.406: J1.A25 153.42,29.69 145.8,29.69 144.53,28.42 JP2.6
ABUS6
  Top 0.406: JP2.7 135.95,25.88 132.14,29.69 111.82,29.69 110.87,30.64 109.6,30.64 108.65,31.6 107.38,31.6 106.43,32.55 105.16,32.55 104.2,33.5 102.93,33.5 101.66,34.77 IC17.8
  Bottom 0.406: J1.C26 145.8,25.88 144.53,24.61 141.99,24.61 JP2.7
ABUS7  (via drill 0.61 pad 1.27)
  Top 0.406: JP2.8 141.99,24.61 v132.14,24.61 | v132.14,40.17 116.59,40.17 114.05,37.63 101.35,37.63 IC17.9
  Bottom 0.406: J1.A26 153.42,27.15 145.8,27.15 144.53,25.88 JP2.8 | v132.14,24.61 v132.14,40.17
ABUS8
  Top 0.406: JP2.9 122.94,23.34 122.3,23.98 118.81,23.98 IC18.2
  Bottom 0.406: J1.C27 145.8,23.34 144.53,22.07 141.99,22.07 JP2.9
ABUS9  (via drill 0.61 pad 1.27)
  Top 0.406: JP2.10 141.99,22.07 v124.84,22.07 | v124.84,24.93 117.22,24.93 IC18.3
  Bottom 0.406: J1.A27 153.42,24.61 145.8,24.61 144.53,23.34 JP2.10 | v124.84,22.07 v124.84,24.93
ABUS10
  Top 0.406: JP2.11 129.6,20.8 128.97,20.17 113.09,20.17 111.82,21.44 IC18.4
  Bottom 0.406: J1.C28 145.8,20.8 144.53,19.53 141.99,19.53 JP2.11
ABUS11
  Top 0.406: JP2.12 141.99,19.53 129.6,19.53 129.29,19.21 112.78,19.21 111.82,20.17 110.55,20.17 109.28,21.44 IC18.5
  Bottom 0.406: J1.A28 153.42,22.07 145.8,22.07 144.53,20.8 JP2.12
ABUS12
  Top 0.406: JP2.13 112.46,18.26 111.51,19.21 110.24,19.21 109.28,20.17 108.01,20.17 106.74,21.44 IC18.6
  Bottom 0.406: J1.C29 145.8,18.26 144.53,16.99 141.99,16.99 JP2.13
ABUS13
  Top 0.406: JP2.14 141.99,16.99 129.6,16.99 129.29,17.31 112.14,17.31 111.19,18.26 109.92,18.26 108.97,19.21 107.7,19.21 106.74,20.17 105.47,20.17 104.2,21.44 IC18.7
  Bottom 0.406: J1.A29 153.42,19.53 145.8,19.53 144.53,18.26 JP2.14
ABUS14
  Top 0.406: JP2.15 129.6,15.72 128.97,16.36 111.82,16.36 110.87,17.31 109.6,17.31 108.65,18.26 107.38,18.26 106.43,19.21 105.16,19.21 104.2,20.17 102.93,20.17 101.66,21.44 IC18.8
  Bottom 0.406: J1.C30 145.8,15.72 144.53,14.45 141.99,14.45 JP2.15
ABUS15  (via drill 0.61 pad 1.27)
  Top 0.406: v138.18,14.13 141.67,14.13 JP2.16 | v126.11,26.2 122.62,26.2 122.3,25.88 116.9,25.88 115,23.98 100.71,23.98 99.12,22.39 IC18.9
  Bottom 0.406: J1.A30 153.42,16.99 145.8,16.99 144.53,15.72 JP2.16 | v126.11,26.2 v138.18,14.13
ALUBUS0
  Top 0.406: IC4.18 57.21,81.76 55.94,80.49 51.82,80.49 50.55,81.76 R1.2 | IC2.2 26.42,85.89 6.41,85.89 JP3.1
  Bottom 0.406: R1.2 47.05,83.03 31.18,83.03 29.91,84.3 IC2.2
ALUBUS1
  Top 0.406: IC4.17 57.21,79.22 55.94,77.95 51.82,77.95 50.55,79.22 R2.2 47.05,80.49 33.08,80.49 31.81,81.76 IC2.3 25.46,84.3 JP3.2
ALUBUS2
  Top 0.406: IC4.16 57.21,76.68 55.94,75.41 51.82,75.41 50.55,76.68 R3.2 47.05,77.95 33.08,77.95 31.81,79.22 IC2.4 24.19,83.03 6.1,83.03 JP3.3
ALUBUS3
  Top 0.406: IC4.15 57.21,74.14 55.94,72.87 51.82,72.87 50.55,74.14 R4.2 47.05,75.41 33.08,75.41 31.81,76.68 IC2.5 22.92,81.76 JP3.4
ALUBUS4
  Top 0.406: IC4.14 57.21,71.6 55.94,70.33 51.82,70.33 50.55,71.6 R5.2 47.05,72.87 33.08,72.87 31.81,74.14 IC2.6 21.65,80.49 6.1,80.49 JP3.5
ALUBUS5
  Top 0.406: IC4.13 57.21,69.06 55.94,67.79 51.82,67.79 50.55,69.06 R6.2 47.05,70.33 33.08,70.33 31.81,71.6 IC2.7 20.38,79.22 JP3.6
ALUBUS6
  Top 0.406: IC4.12 57.21,66.52 55.94,65.25 51.82,65.25 50.55,66.52 R7.2 47.05,67.79 33.08,67.79 31.81,69.06 IC2.8 19.11,77.95 6.1,77.95 JP3.7
ALUBUS7
  Top 0.406: R8.2 47.05,65.25 33.08,65.25 31.81,66.52 IC2.9 17.84,76.68 JP3.8
  Bottom 0.406: IC4.11 57.21,63.98 55.94,62.71 51.82,62.71 50.55,63.98 R8.2
ALUBUS8
  Top 0.406: IC19.18 81.98,81.76 83.25,80.49 90.55,80.49 91.82,81.76 IC3.18
  Bottom 0.406: IC19.18 76.26,84.62 76.26,89.7 71.5,94.46 27.69,94.46 8.64,75.41 6.1,75.41 JP3.9
ALUBUS9
  Top 0.406: IC19.17 81.98,79.22 83.25,77.95 90.55,77.95 91.82,79.22 IC3.17
  Bottom 0.406: IC19.17 75.31,83.03 75.31,88.11 72.77,90.65 25.78,90.65 9.27,74.14 JP3.10
ALUBUS10
  Top 0.406: IC19.16 81.98,76.68 83.25,75.41 90.55,75.41 91.82,76.68 IC3.16
  Bottom 0.406: IC19.16 74.36,81.44 74.36,87.8 72.45,89.7 26.42,89.7 9.59,72.87 6.1,72.87 JP3.11
ALUBUS11
  Top 0.406: IC19.15 81.98,74.14 83.25,72.87 90.55,72.87 91.82,74.14 IC3.15
  Bottom 0.406: JP3.12 9.91,71.6 27.05,88.75 72.14,88.75 73.41,87.48 73.41,79.86 IC19.15
ALUBUS12
  Top 0.406: IC19.14 81.98,71.6 83.25,70.33 90.55,70.33 91.82,71.6 IC3.14
  Bottom 0.406: IC19.14 74.36,66.84 74.36,62.71 73.09,61.44 22.29,61.44 13.4,70.33 6.1,70.33 JP3.13
ALUBUS13
  Top 0.406: IC19.13 81.98,69.06 83.25,67.79 90.55,67.79 91.82,69.06 IC3.13
  Bottom 0.406: IC19.13 75.63,65.57 75.63,62.71 73.41,60.49 21.34,60.49 12.76,69.06 JP3.14
ALUBUS14
  Top 0.406: IC19.12 81.98,66.52 83.25,65.25 90.55,65.25 91.82,66.52 IC3.12
  Bottom 0.406: IC19.12 76.58,63.98 76.58,62.08 74.04,59.54 20.07,59.54 11.81,67.79 6.1,67.79 JP3.15
ALUBUS15
  Top 0.406: IC19.11 81.98,63.98 83.25,62.71 90.55,62.71 91.82,63.98 IC3.11
  Bottom 0.406: IC19.11 79.12,63.03 74.68,58.58 18.8,58.58 10.86,66.52 JP3.16
BUSCLK
  Top 0.406: 101.66,48.43 98.17,48.43 96.58,46.84 IC14.11 | 101.66,48.43 128.65,48.43 129.6,49.38 129.6,54.46 130.56,55.41 132.46,55.41 133.41,54.46 IC13.3 | IC14.13 101.66,48.43
BUSCLKA
  Bottom 0.406: IC14.9 97.85,51.92 97.85,9.37 JP10.23
BUSCLKB
  Bottom 0.406: IC14.7 100.39,49.38 100.39,6.83 JP10.24
CLK0
  Top 0.406: IC9.12 57.21,49.38 127.7,49.38 128.33,50.01 IC13.1 128.33,54.78 129.92,56.36 134.37,56.36 135.95,54.78 IC13.4 IC13.5
  Bottom 0.406: IC9.5 53.4,48.11 IC9.12
CLK0A
  Bottom 0.406: IC14.18 114.36,40.17 115.63,38.9 115.63,13.18 111.82,9.37 JP10.13
CLK0B
  Bottom 0.406: IC14.16 108.01,44.3 108.01,7.47 106.74,6.2 JP10.18
CLK0C
  Bottom 0.406: IC14.14 102.93,44.3 102.93,9.37 JP10.19
CLK0D  (via drill 0.61 pad 1.27)
  Top 0.406: v105.47,42.39 102.3,42.39 IC14.12
  Bottom 0.406: v105.47,42.39 105.47,9.37 JP10.17
CLK1
  Bottom 0.406: IC14.5 110.55,51.92 110.55,4.29 110.87,3.98 115.32,3.98 JP10.10
DBUS0
  Top 0.406: J1.C3 149.29,83.99 145.48,83.99 144.53,83.03 141.99,83.03 JP1.1 R9.2 135.32,85.57 118.49,85.57 IC6.2 115.95,85.57 91.82,85.57 90.55,84.3 IC3.2 85.15,85.57 54.99,85.57 IC4.2
DBUS1
  Top 0.406: J1.C4 149.29,81.44 145.48,81.44 144.53,80.49 141.99,80.49 JP1.3 R10.2 135.32,83.03 118.49,83.03 IC6.3 115.95,83.03 91.82,83.03 90.55,81.76 IC3.3 83.25,81.76 81.98,83.03 57.21,83.03 55.94,81.76 IC4.3
DBUS2
  Top 0.406: J1.C5 149.29,78.91 145.48,78.91 144.53,77.95 141.99,77.95 JP1.5 R11.2 135.32,80.49 118.49,80.49 IC6.4 115.95,80.49 91.82,80.49 90.55,79.22 IC3.4 83.25,79.22 81.98,80.49 57.21,80.49 55.94,79.22 IC4.4
DBUS3
  Top 0.406: J1.C6 149.29,76.36 145.48,76.36 144.53,75.41 141.99,75.41 JP1.7 R12.2 135.32,77.95 118.49,77.95 IC6.5 115.95,77.95 91.82,77.95 90.55,76.68 IC3.5 83.25,76.68 81.98,77.95 57.21,77.95 55.94,76.68 IC4.5
DBUS4
  Top 0.406: J1.C7 149.29,73.83 145.48,73.83 144.53,72.87 141.99,72.87 JP1.9 R13.2 135.32,75.41 118.49,75.41 IC6.6 115.95,75.41 91.82,75.41 90.55,74.14 IC3.6 83.25,74.14 81.98,75.41 57.21,75.41 55.94,74.14 IC4.6
DBUS5
  Top 0.406: J1.C8 149.29,71.29 145.48,71.29 144.53,70.33 141.99,70.33 JP1.11 R14.2 135.32,72.87 118.49,72.87 IC6.7 115.63,70.02 99.76,70.02 96.9,72.87 91.82,72.87 90.55,71.6 IC3.7 83.25,71.6 81.98,72.87 57.21,72.87 55.94,71.6 IC4.7
DBUS6
  Top 0.406: J1.C9 149.29,68.74 145.48,68.74 144.53,67.79 141.99,67.79 JP1.13 R15.2 135.32,70.33 118.49,70.33 IC6.8 97.54,69.06 96.27,70.33 91.82,70.33 90.55,69.06 IC3.8 83.25,69.06 81.98,70.33 57.21,70.33 55.94,69.06 IC4.8
DBUS7
  Top 0.406: J1.C10 149.29,66.21 145.48,66.21 144.53,65.25 141.99,65.25 JP1.15 R16.2 135.32,67.79 118.49,67.79 IC6.9 115.95,67.79 91.82,67.79 90.55,66.52 IC3.9 83.25,66.52 81.98,67.79 71.5,67.79 | 71.5,67.79 57.21,67.79 55.94,66.52 IC4.9 | IC19.8 71.5,67.79
  Bottom 0.406: IC19.2 IC19.3 IC19.4 IC19.5 IC19.6 IC19.7 IC19.8 IC19.9
GND
  Bottom 0.406: LED1.K 8.95,46.56 S1.4
  pour Top (isolate 0.61): 0.06,99.86 160.08,99.86 160.08,-0.15 0.06,-0.15
  pour Bottom (isolate 0.61): 0.06,99.86 160.08,99.86 160.08,-0.15 0.06,-0.15
IRQ0
  Top 0.406: J1.A3 153.42,85.57 148.65,85.57 148.34,85.25 145.48,85.25 144.53,84.3 JP1.2
IRQ1
  Top 0.406: J1.A4 153.42,83.03 148.65,83.03 148.34,82.72 145.48,82.72 144.53,81.76 JP1.4
IRQ2
  Top 0.406: J1.A5 153.42,80.49 148.65,80.49 148.34,80.18 145.48,80.18 144.53,79.22 JP1.6
IRQ3
  Top 0.406: J1.A6 153.42,77.95 148.65,77.95 148.34,77.63 145.48,77.63 144.53,76.68 JP1.8
IRQ4
  Top 0.406: J1.A7 153.42,75.41 148.65,75.41 148.34,75.1 145.48,75.1 144.53,74.14 JP1.10
IRQ5
  Top 0.406: J1.A8 153.42,72.87 148.65,72.87 148.34,72.55 145.48,72.55 144.53,71.6 JP1.12
IRQ6
  Top 0.406: J1.A9 153.42,70.33 148.65,70.33 148.34,70.02 145.48,70.02 144.53,69.06 JP1.14
IRQ7
  Top 0.406: J1.A10 153.42,67.79 148.65,67.79 148.34,67.47 145.48,67.47 144.53,66.52 JP1.16
N$1
  Bottom 0.406: IC1.3 99.12,84.3 IC3.19
N$2
  Bottom 0.406: IC1.6 100.39,72.87 76.9,72.87 73.41,69.38 73.41,63.03 72.77,62.39 69.28,62.39 66.74,64.94 66.74,81.76 64.2,84.3 IC4.19
N$3
  Top 0.406: R1.1 IC2.18
N$4
  Top 0.406: R2.1 IC2.17
N$5
  Top 0.406: IC2.16 R3.1
N$6
  Top 0.406: IC2.15 R4.1
N$7
  Top 0.406: IC2.14 R5.1
N$8
  Top 0.406: IC2.13 R6.1
N$9
  Top 0.406: IC2.12 R7.1
N$10
  Top 0.406: IC2.11 R8.1
N$11
  Bottom 0.406: R9.1 126.43,81.76 IC6.18
N$12
  Bottom 0.406: R10.1 126.43,79.22 IC6.17
N$13
  Bottom 0.406: R11.1 126.43,76.68 IC6.16
N$14
  Bottom 0.406: R12.1 126.43,74.14 IC6.15
N$15
  Bottom 0.406: R13.1 126.43,71.6 IC6.14
N$16
  Bottom 0.406: R15.1 126.43,66.52 IC6.12
N$17
  Bottom 0.406: R16.1 126.43,63.98 IC6.11
N$18
  Bottom 0.406: R14.1 126.43,69.06 IC6.13
N$19
  Top 0.406: S1.1 S1.2
  Bottom 0.406: S1.1 19.11,24.82 19.11,5.88 20.07,4.93 IC12.1
N$20
  Top 0.406: IC10.11 69.91,48.11 IC10.3 58.48,48.11 IC9.11 53.4,48.11 IC9.3
  Bottom 0.406: IC9.3 40.7,55.73 OSC1.8
N$21
  Top 0.406: R18.1 LED1.A
N$22
  Top 0.406: IC9.8 52.13,41.76 47.05,41.76 46.1,42.71 46.1,49.69 47.05,50.65 IC9.2
N$23  (via drill 0.61 pad 1.27)
  Top 0.406: IC14.17 104.84,38.58 94.68,38.58 90.87,34.77 v63.88,34.77
  Bottom 0.406: v63.88,34.77 51.5,22.39 51.5,6.2 IC15.5
N$24
  Bottom 0.406: IC12.6 28,14.45 29.91,14.45 R19.1 34.99,14.45 36.58,14.45 38.8,12.23 38.8,8.74 IC15.2
N$25  (via drill 0.61 pad 1.27)
  Top 0.406: IC10.8 69.91,40.49 v67.37,40.49
  Bottom 0.406: v67.37,40.49 66.1,41.76 63.56,41.76 62.93,42.39 62.93,48.74 IC10.2
N$26
  Top 0.406: IC14.8 104.2,50.65 106.74,50.65 | 106.74,50.65 111.82,50.65 | 111.82,50.65 116.9,50.65 | 116.9,50.65 121.03,50.65 122.94,52.55 122.94,54.14 127.06,58.27 136.27,58.27 137.22,59.22 137.22,62.08 138.18,63.03 142.62,63.03 143.57,62.08 IC13.8 | IC14.6 106.74,50.65 | IC14.2 116.9,50.65 | IC14.4 111.82,50.65
N$27
  Bottom 0.406: IC9.1 49.59,53.19 50.86,51.92 58.8,51.92 61.34,54.46 67.37,54.46 69.91,51.92 80.07,51.92 82.93,49.06 82.93,23.98 80.71,21.75 80.71,9.69 IC11.13
N$28
  Top 0.406: C1.+ R17.1
  Bottom 0.406: R17.1 26.73,39.22 67.69,39.22 70.23,41.76 74.04,41.76 74.99,42.71 74.99,47.15 75.95,48.11 IC16.3
N$29
  Top 0.406: IC13.10 IC13.9 IC13.6
N$30  (via drill 0.61 pad 1.27)
  Top 0.406: IC12.7 27.05,9.05 41.34,9.05 45.15,5.24 IC15.3 | v58.8,36.36 58.8,37.63 IC9.9 57.21,41.76 74.04,41.76 74.99,42.71 74.99,45.89 75.95,46.84 91.19,46.84 96.9,41.12 106.11,41.12 106.74,41.76 IC14.15 108.65,47.47 129.29,47.47 130.87,49.06 IC13.2
  Bottom 0.406: v58.8,36.36 48.32,25.88 35.94,25.88 23.56,13.5 IC12.7
N$31
  Bottom 0.406: IC10.5 69.91,48.11 IC10.12
N$32
  Bottom 0.406: IC11.1 75.95,10.01 70.87,10.01 69.6,11.28 69.6,37.63 IC10.9
N$33
  Top 0.406: IC11.14 73.41,10.01 IC11.3
  Bottom 0.406: IC16.2 80.07,50.65 81.98,48.74 81.98,24.61 73.41,16.04 IC11.3
N$34
  Bottom 0.406: IC16.4 IC16.5
N$35
  Top 0.406: IC9.13 57.21,51.92 71.18,51.92 IC10.13
  Bottom 0.406: IC10.13 74.99,50.65 76.26,49.38 80.07,49.38 81.03,48.43 81.03,41.44 80.07,40.49 IC16.6
PABUS12
  Bottom 0.406: JP5.1 142.62,50.65 143.89,50.65 147.07,53.82 J1.C15
PABUS13
  Bottom 0.406: JP5.2 144.53,48.74 148.34,52.55 153.42,52.55 J1.A15
PABUS14
  Bottom 0.406: JP5.3 141.99,47.47 144.53,47.47 148.34,51.28 J1.C16
PABUS15
  Bottom 0.406: JP5.4 144.53,46.2 148.34,50.01 153.42,50.01 J1.A16
PABUS16
  Bottom 0.406: JP5.5 141.99,44.93 144.53,44.93 148.34,48.74 J1.C17
PABUS17
  Bottom 0.406: JP5.6 144.53,43.66 148.34,47.47 153.42,47.47 J1.A17
PABUS18
  Bottom 0.406: JP5.7 141.99,42.39 144.53,42.39 148.34,46.2 J1.C18
PABUS19
  Bottom 0.406: JP5.8 144.53,41.12 148.34,44.93 153.42,44.93 J1.A18
PABUS20
  Bottom 0.406: JP5.9 141.99,39.85 144.53,39.85 148.34,43.66 J1.C19
PABUS21
  Bottom 0.406: JP5.10 144.53,38.58 148.34,42.39 153.42,42.39 153.73,42.71 154.05,43.03 J1.A19
RBUS0  (via drill 0.61 pad 1.27)
  Top 0.406: IC17.18 111.51,24.93 32.13,24.93 31.5,24.3 v28.64,24.3 | v28.64,35.09 6.41,35.09 JP4.1
  Bottom 0.406: v28.64,24.3 v28.64,35.09
RBUS1
  Top 0.406: IC17.17 109.92,29.69 109.28,29.69 108.33,30.64 107.06,30.64 106.11,31.6 104.84,31.6 103.89,32.55 102.62,32.55 101.66,33.5 JP4.2
RBUS2
  Top 0.406: IC17.16 107.38,29.69 106.74,29.69 105.79,30.64 104.52,30.64 103.57,31.6 102.3,31.6 101.35,32.55 13.4,32.55 13.08,32.23 6.1,32.23 JP4.3
RBUS3
  Top 0.406: IC17.15 104.84,29.69 104.2,29.69 103.25,30.64 101.98,30.64 101.03,31.6 13.72,31.6 13.08,30.96 JP4.4
RBUS4
  Top 0.406: IC17.14 102.3,29.69 101.66,29.69 100.71,30.64 14.03,30.64 13.08,29.69 6.1,29.69 JP4.5
RBUS5
  Top 0.406: IC17.13 99.76,29.69 14.35,29.69 13.08,28.42 JP4.6
RBUS6  (via drill 0.61 pad 1.27)
  Top 0.406: IC17.12 97.22,25.88 v15.3,25.88
  Bottom 0.406: v15.3,25.88 14.03,27.15 6.1,27.15 JP4.7
RBUS7
  Top 0.406: IC17.11 14.67,27.79 12.76,25.88 JP4.8
RBUS8  (via drill 0.61 pad 1.27)
  Top 0.406: IC18.18 111.19,11.28 v86.42,11.28 | JP4.9 6.1,24.61 11.81,24.61 13.72,22.71 v86.42,22.71
  Bottom 0.406: v86.42,11.28 v86.42,22.71
RBUS9
  Top 0.406: IC18.17 111.82,15.09 110.55,16.36 109.28,16.36 108.33,17.31 107.06,17.31 106.11,18.26 104.84,18.26 103.89,19.21 102.62,19.21 101.66,20.17 13.4,20.17 10.22,23.34 JP4.10
RBUS10
  Top 0.406: IC18.16 109.28,15.09 108.01,16.36 106.74,16.36 105.79,17.31 104.52,17.31 103.57,18.26 102.3,18.26 101.35,19.21 13.08,19.21 10.22,22.07 6.1,22.07 JP4.11
RBUS11
  Top 0.406: IC18.15 106.74,14.77 105.16,16.36 104.2,16.36 103.25,17.31 101.98,17.31 101.03,18.26 12.76,18.26 10.22,20.8 JP4.12
RBUS12
  Top 0.406: IC18.14 104.2,15.09 102.93,16.36 101.66,16.36 100.71,17.31 12.45,17.31 10.22,19.53 6.1,19.53 JP4.13
RBUS13
  Top 0.406: IC18.13 101.66,15.09 100.39,16.36 12.13,16.36 10.22,18.26 JP4.14
RBUS14
  Top 0.406: IC18.12 97.22,12.55 92.46,12.55 90.55,14.45 12.13,14.45 11.49,13.82 6.73,13.82 JP4.15
RBUS15
  Top 0.406: IC18.11 95.63,15.4 7.68,15.4 JP4.16
RST  (via drill 0.61 pad 1.27)
  Top 0.406: v61.66,3.02 61.98,2.7 116.59,2.7 118.17,4.29 118.17,6.83 JP10.9 | v57.53,3.02 54.04,3.02 52.77,4.29 IC15.6
  Bottom 0.406: v61.66,3.02 v57.53,3.02

### Text on the board
Top: #0
_tsilk: VCC2 | +5V | GND | GND1 | IC2 | IC4 | IC19 | IC3 | IC1 | IC6 | POWER | JP3 | 74LS08N | JP1 | 74LS541N | 74LS245N | 74LS541N | 74LS245N | 74LS541N | 10k | 10k | IC13 | OSC1 | LED1 | 74LS32N | IC9 | IC10 | IC16 | 74LS74N | 74LS74N | 74LS14N | 16.000MHz | 400 | 74LS244N | JP5 | R18 | IC14 | 10u | R17 | S1 | 10k | C1 | JP4 | IC17 | JP2 | 74LS541N | IC18 | 74LS541N | IC11 | R19 | GND2 | 4k | 74LS73N | VCC1 | 10u | MAX1232 | 74LS74N | IC12 | JP10 | IC15